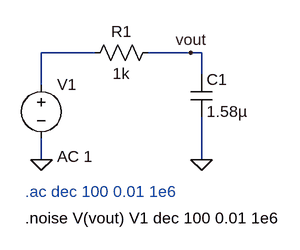
[diagram p0: schematic RC_single.asc]
RC_single.asc, the LTspice schematic file:
Version 4
SHEET 1 880 680
WIRE 48 112 -32 112
WIRE 192 112 128 112
WIRE 208 112 192 112
WIRE 208 144 208 112
WIRE -32 160 -32 112
WIRE -32 272 -32 240
WIRE 208 272 208 208
FLAG 208 272 0
FLAG -32 272 0
FLAG 192 112 vout
SYMBOL res 144 96 R90
WINDOW 0 0 56 VBottom 2
WINDOW 3 32 56 VTop 2
SYMATTR InstName R1
SYMATTR Value 1k
SYMBOL cap 192 144 R0
SYMATTR InstName C1
SYMATTR Value 1.58µ
SYMBOL voltage -32 144 R0
WINDOW 123 24 124 Left 2
WINDOW 39 0 0 Left 0
SYMATTR Value2 AC 1
SYMATTR InstName V1
SYMATTR Value ""
TEXT -56 320 Left 2 ;.ac dec 100 0.01 1e6
TEXT -56 360 Left 2 !.noise V(vout) V1 dec 100 0.01 1e6

The netlist it stands for:
* RC_single.asc
R1 vout N001 1k
C1 vout 0 1.58µ
V1 N001 0 AC 1
* .ac dec 100 0.01 1e6
.noise V(vout) V1 dec 100 0.01 1e6
.backanno
.end